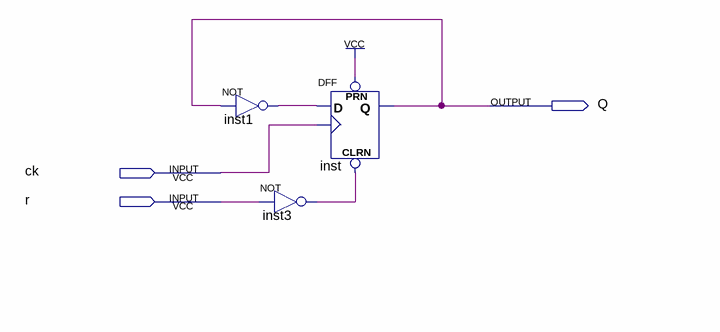
[diagram p0: schematic sheet]
// Quartus schematic bfs_flipflop.bdf as structural Verilog: 3 symbols, 3 pins
module bfs_flipflop (
  input  ck,
  input  r,
  output Q
);

  wire inst1_out, inst3_out;

  not inst1 (inst1_out, Q);
  DFF inst (.CLRN(inst3_out), .CLK(ck), .D(inst1_out), .PRN(1'b1), .Q(Q));
  not inst3 (inst3_out, r);
endmodule
